# Altium schematic sheet Science.SchDoc
size A4
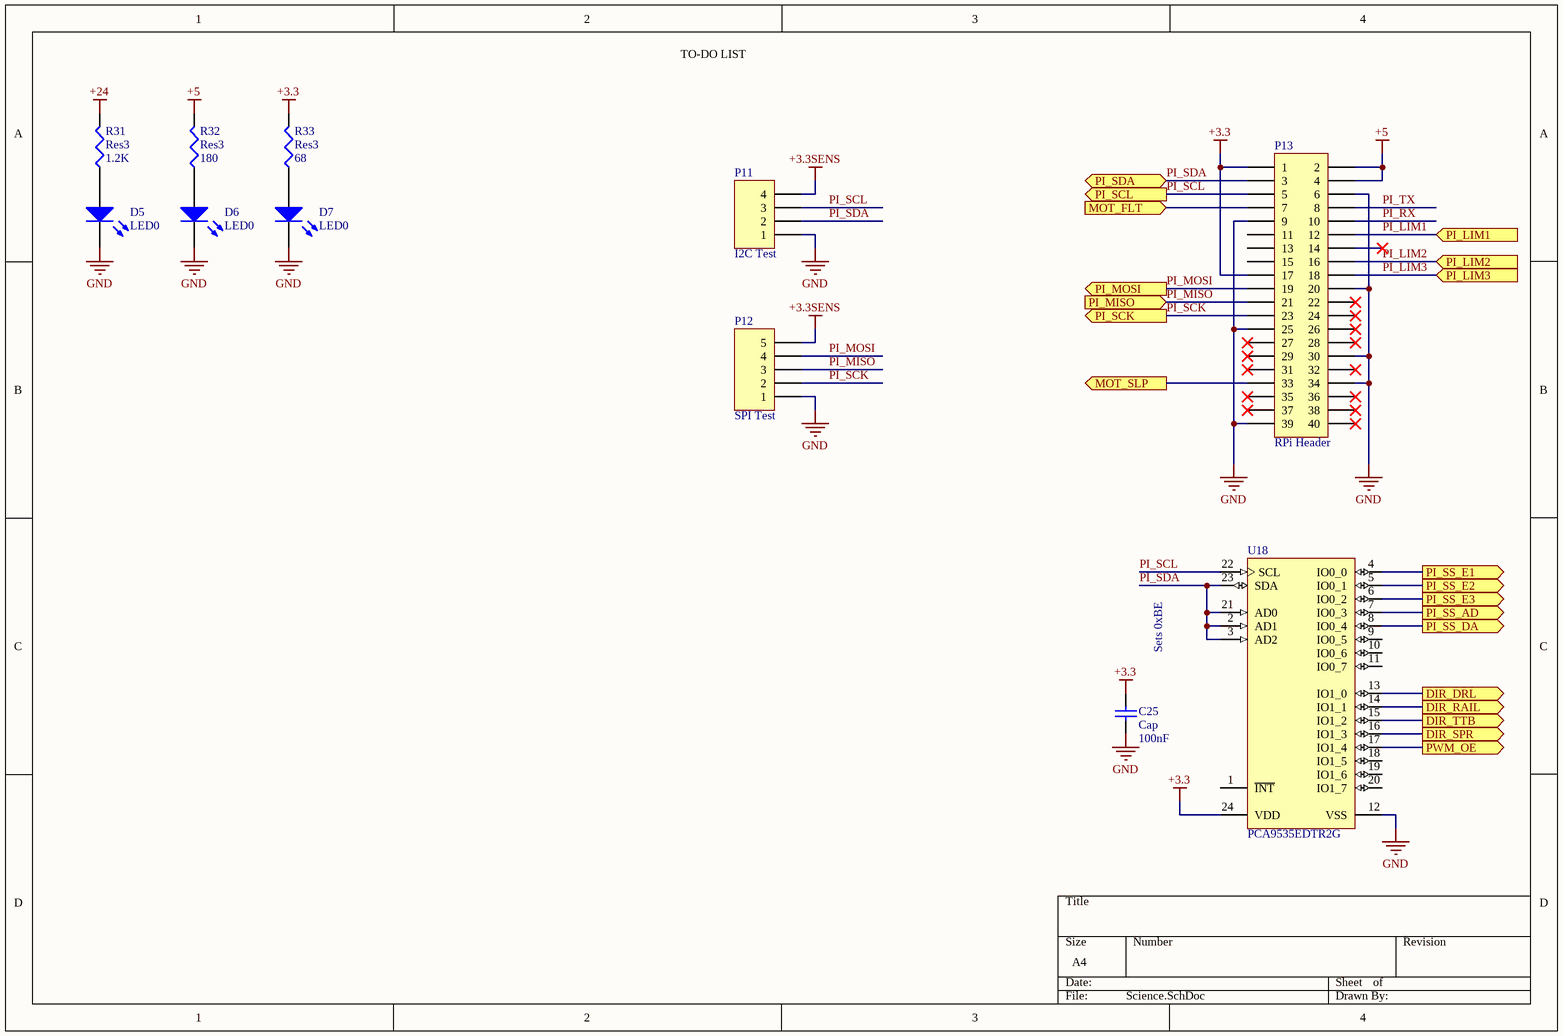
[diagram p0: Science.SchDoc]

## Parts
C25  Cap  value 100nF  [C0805]
D5  LED0  [1608[0603]]
D6  LED0  [1608[0603]]
D7  LED0  [1608[0603]]
P11  I2C Test  [HDR1X4]
P12  SPI Test  [HDR1X5]
P13  RPi Header  [RPi-3B+]
R31  Res3  value 1.2K  [C0805]
R32  Res3  value 180  [C0805]
R33  Res3  value 68  [C0805]
U18  PCA9535EDTR2G  [ONSC-TSSOP-24-948H_V]

## Ports
DIR_DRL (out), DIR_RAIL (out), DIR_SPR (out), DIR_TTB (out), MOT_FLT (in), MOT_SLP (out), PI_LIM1 (in), PI_LIM2 (in), PI_LIM3 (in), PI_MISO (in), PI_MOSI (out), PI_SCK (out), PI_SCL (out), PI_SDA (bidir), PI_SS_AD (out), PI_SS_DA (out), PI_SS_E1 (out), PI_SS_E2 (out), PI_SS_E3 (out), PWM_OE (out)

## Nets
+3.3: C25.2 P13.1 P13.17 R33.2 U18.24(VDD)
+3.3SENS: P11.4 P12.5
+5: P13.2 P13.4 R32.2
+24: R31.2
GND: C25.1 D5.2(K) D6.2(K) D7.2(K) P11.1 P12.1 P13.6 P13.9 P13.20 P13.25 P13.30 P13.34 P13.39 U18.12(VSS)
DIR_DRL: U18.13(IO1_0) ; port DIR_DRL
DIR_RAIL: U18.14(IO1_1) ; port DIR_RAIL
DIR_SPR: U18.16(IO1_3) ; port DIR_SPR
DIR_TTB: U18.15(IO1_2) ; port DIR_TTB
MOT_FLT: P13.7 ; port MOT_FLT
MOT_SLP: P13.33 ; port MOT_SLP
PI_LIM1: P13.12 ; port PI_LIM1
PI_LIM2: P13.16 ; port PI_LIM2
PI_LIM3: P13.18 ; port PI_LIM3
PI_MISO: P12.3 P13.21 ; port PI_MISO
PI_MOSI: P12.4 P13.19 ; port PI_MOSI
PI_RX: P13.10
PI_SCK: P12.2 P13.23 ; port PI_SCK
PI_SCL: P11.3 P13.5 U18.22(SCL) ; port PI_SCL
PI_SDA: P11.2 P13.3 U18.2(AD1) U18.3(AD2) U18.21(AD0) U18.23(SDA) ; port PI_SDA
PI_SS_AD: U18.7(IO0_3) ; port PI_SS_AD
PI_SS_DA: U18.8(IO0_4) ; port PI_SS_DA
PI_SS_E1: U18.4(IO0_0) ; port PI_SS_E1
PI_SS_E2: U18.5(IO0_1) ; port PI_SS_E2
PI_SS_E3: U18.6(IO0_2) ; port PI_SS_E3
PI_TX: P13.8
PWM_OE: U18.17(IO1_4) ; port PWM_OE
NetD5_1: D5.1(A) R31.1
NetD6_1: D6.1(A) R32.1
NetD7_1: D7.1(A) R33.1

Not connected (* = marked no-connect by the designer): P13 11 13 14* 15 22* 24* 26* 27* 28* 29* 31* 32* 35* 36* 37* 38* 40*; U18 1(~{INT}) 9(IO0_5) 10(IO0_6) 11(IO0_7) 18(IO1_5) 19(IO1_6) 20(IO1_7)

## Notes on the sheet
- TO-DO LIST
- Sets 0xBE

## Library data of the parts
C25 = Cap: Capacitor; Published: 8-Jun-2000; LatestRevisionDate: 17-Jul-2002; LatestRevisionNote: Re-released for DXP Platform.; PackageReference: RAD-0.3; Publisher: Altium Limited; PackageDescription: Radial Cap, Thru-Hole; 2 Leads; 0.3 in Pin Spacing
D5-D7 = LED0: Typical INFRARED GaAs LED; Published: 8-Jun-2000; LatestRevisionDate: 08-Jul-2005; LatestRevisionNote: Mech Layer 1 removed.; PackageReference: LED-0; Publisher: Altium Limited; PackageDescription: LED; 2 Leads
P11 = Header 4: Header, 4-Pin; LatestRevisionDate: 17-Jul-2002; LatestRevisionNote: Re-released for DXP Platform.; Publisher: Altium Limited
P12 = Header 5: Header, 5-Pin; LatestRevisionDate: 17-Jul-2002; LatestRevisionNote: Re-released for DXP Platform.; Publisher: Altium Limited
P13 = Header 20X2: Header, 20-Pin, Dual row; LatestRevisionDate: 17-Jul-2002; LatestRevisionNote: Re-released for DXP Platform.; Publisher: Altium Limited
R31-R33 = Res3: Resistor; Published: 8-Jun-2000; LatestRevisionDate: 29-May-2009; LatestRevisionNote: IPC-7351 Footprint Added.; PackageReference: J1-0603; Publisher: Altium Limited; PackageDescription: Chip Resistor
U18 = CMP-1316-00043-1: 16-Bit Low-Power I/O Expander for I2C Bus with Interrupt, 1.65 to 5.5 V, -55 to 125 degC, 24-Pin TSSOP, Pb-Free, Tape and Reel; Manufacturer: On Semiconductor; VCC Min (V): 1.65; LED Blink/PWM: No; I/O: 16; VCC Max (V): 5.5; RoHS: TRUE; DatasheetVersion: Rev. 5; ComponentLink3Description: Package Specification; PackageVersion: Rev. B, 06/2012; ComponentLink3URL: http://www.onsemi.cn/pub_link/Collateral/948H-01.PDF; Mounting Technology: Surface Mount; ComponentLink2URL: http://www.onsemi.com/pub_link/Collateral/PCA9535E-D.PDF; PartNumber: PCA9535EDTR2G; ComponentLink1Description: Manufacturer URL; ComponentLink1URL: http://www.onsemi.com/; PackageReference: TSSOP-24-948H; ComponentLink2Description: Datasheet; PackageDescription: 24-Pin Small Outline Package, Body 7.8 x 4.4 mm, Pitch 0.65 mm; Packing: Tape and Reel